# EAGLE design load_cell_amp_diy (EAGLE 9.5.2)
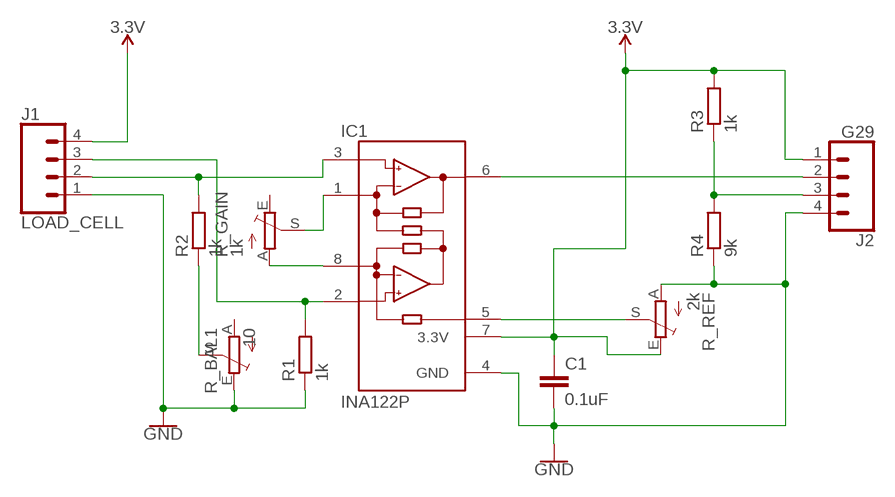
[diagram p0: schematic, sheet 1]

## Parts
C1  0.1uF  C2,5-3  [C2.5-3]
IC1  INA122P  [DIL08]
J1  LOAD_CELL  M04  [04P]
J2  G29  M04  [04P]
R1  1k  R-EU_0207/10  [0207/10]
R2  1k  R-EU_0207/10  [0207/10]
R3  1k  R-EU_0207/10  [0207/10]
R4  9k  R-EU_0207/10  [0207/10]
R_BAL1  10  TRIM_EU-RJ9W  [RJ9W]
R_GAIN  1k  TRIM_EU-RJ9W  [RJ9W]
R_REF  2k  TRIM_EU-RJ9W  [RJ9W]

## Nets
3.3V: C1.1 IC1.7(3.3V) J1.4 J2.1 R3.2 R_REF.E
CLUTCH: IC1.6(OUT) J2.2
GND: C1.2 IC1.4(GND) J1.1 J2.4 R1.1 R4.1 R_BAL1.E R_REF.A
N$1: IC1.8(RG) R_GAIN.A
N$2: IC1.1(RG) R_GAIN.S
N$3: IC1.3(+IN) J1.2 R2.2
N$4: IC1.2(-IN) J1.3 R1.2
N$5: R2.1 R_BAL1.S
N$6: IC1.5(REF) R_REF.S
N$9: J2.3 R3.1 R4.2
Unconnected: R_BAL1.A R_GAIN.E

## Library data of the parts
C1 = load_cell_amp:C: CAPACITOR naming: grid - package width
IC1 = load_cell_amp:INA122: Instrumentation Amplifier Single Supply, MicroPower; MF: TEXAS INSTRUMENTS; MPN: INA122P; OC_FARNELL: 1459460; OC_NEWARK: 15M0948
J1 J2 = load_cell_amp:M04: AMP QUICK CONNECTOR; OC_FARNELL: unknown; OC_NEWARK: unknown
R1-R4 = load_cell_amp:R-EU_: RESISTOR, European symbol; SPICEPREFIX: R
R_BAL1 R_GAIN R_REF = load_cell_amp:TRIM_EU-: POTENTIOMETER

## Board
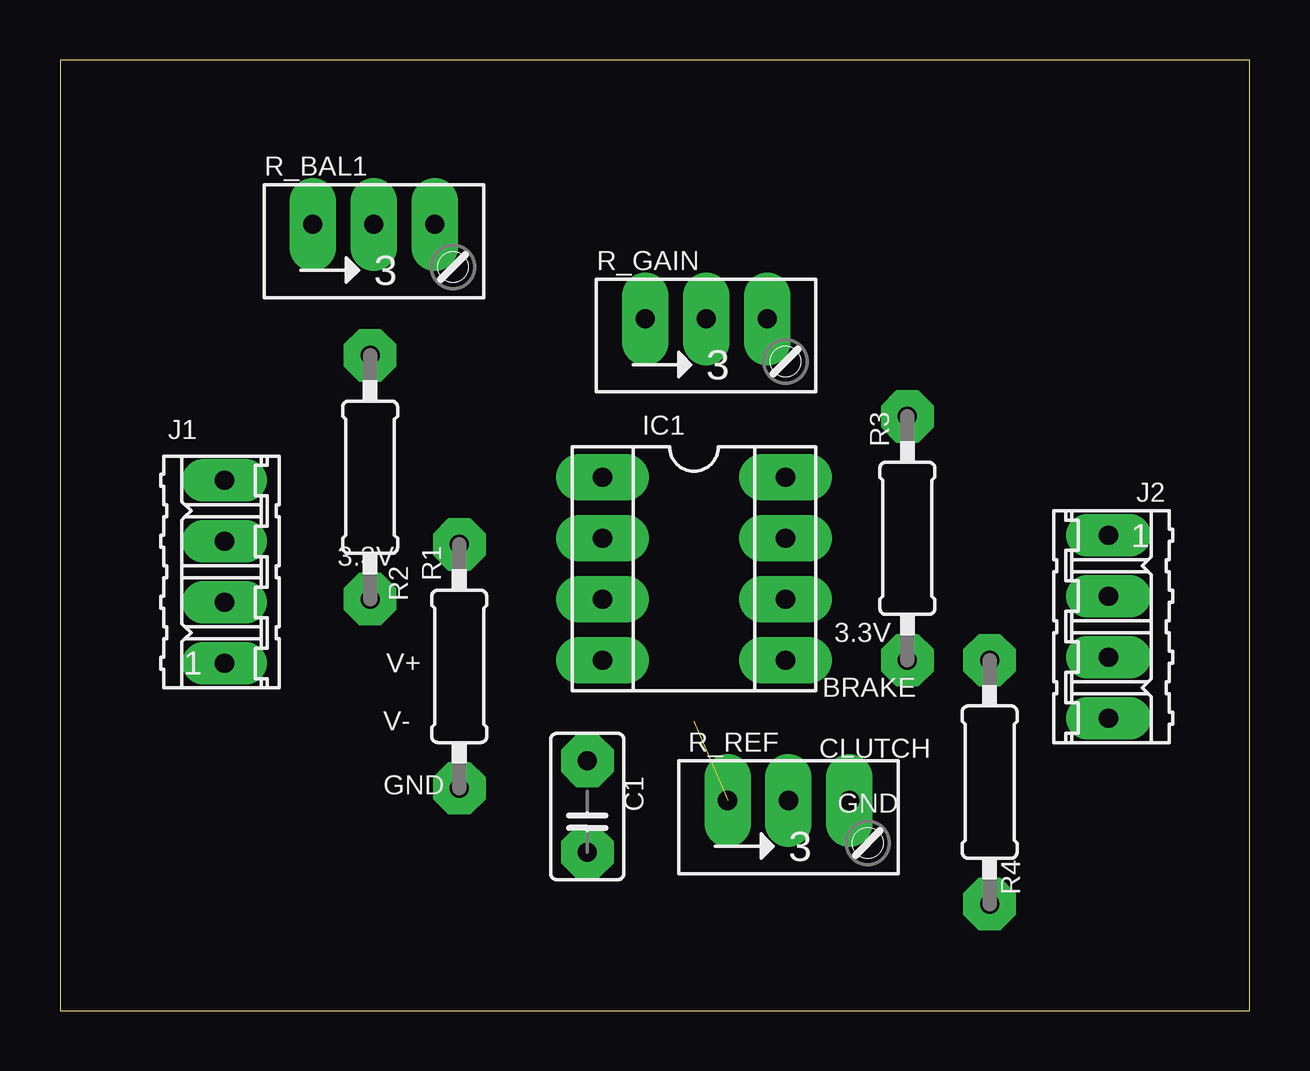
[diagram p1: board, top side]
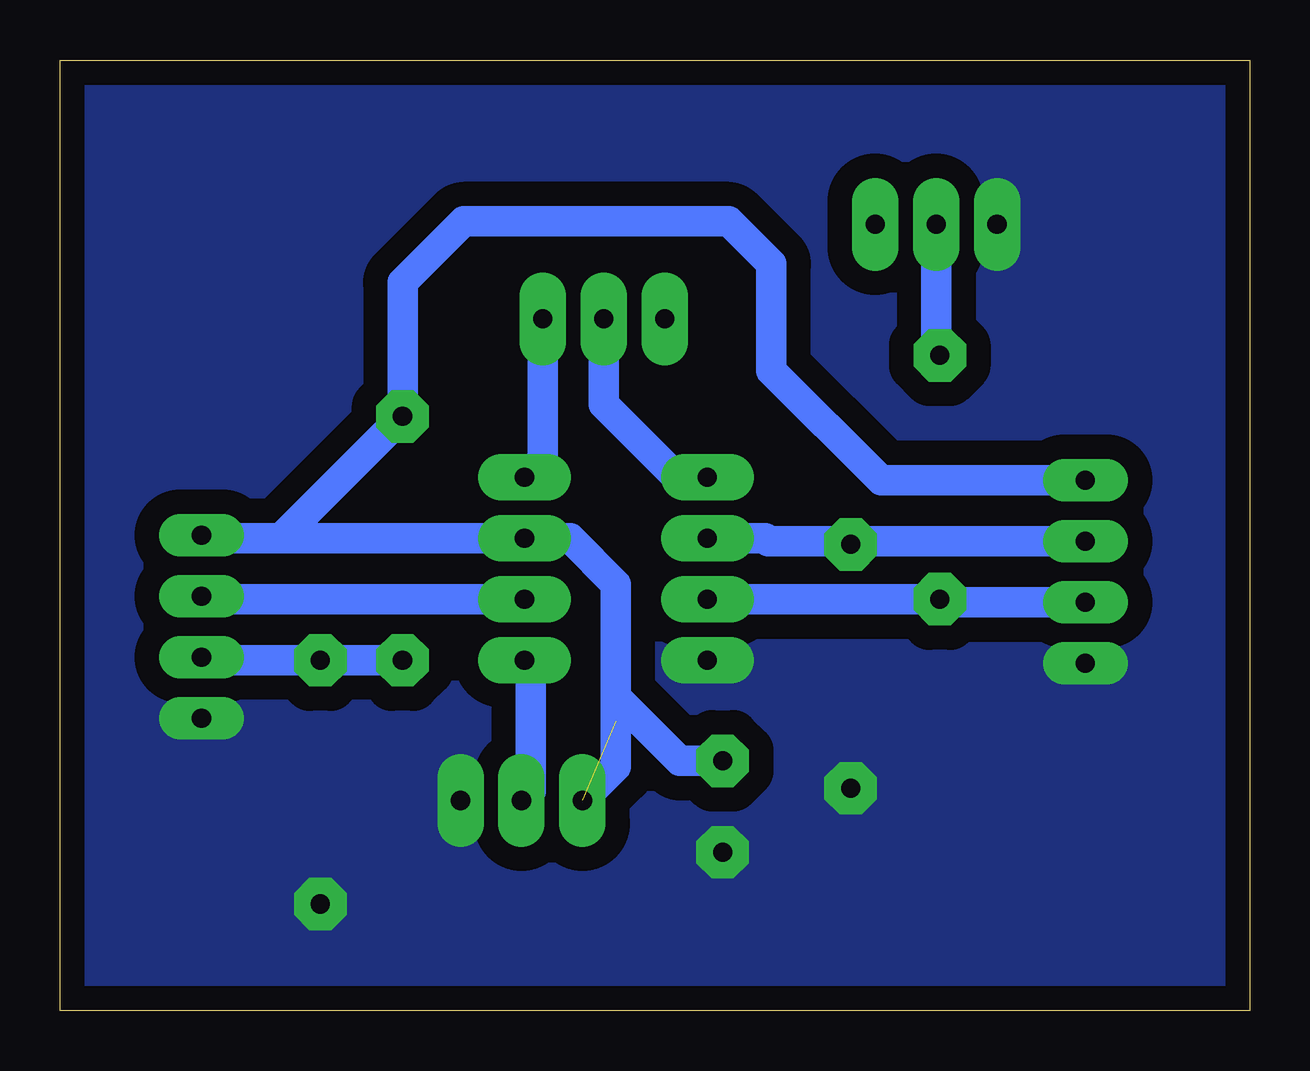
[diagram p2: board, bottom side, seen from below]

Size 49.58 x 39.61 mm. Coordinates in mm from the lower left corner, seen from the top.
Outline: 0,0 49.58,0 49.58,39.61 0,39.61 0,0
Copper layers (1*16): Top 0.035mm / dielectric 1.5mm / Bottom 0.035mm
Design rules "default": minimum track width 6mil, minimum drill 0.35mm, track to track 6mil, track to pad 6mil, pad to pad 6mil, via to via 6mil, smd to smd 6mil, copper to edge 40mil, drill to drill 6mil, minimum pad ring 10mil, minimum via ring 8mil, stop-mask expansion 4mil, vias tented up to drill 0mil, thermal gap 10mil

### Footprints (pad centres in the part's own frame; a part is rotated, then mirrored left to right if it is on the bottom)
C2.5-3 = drill 0.8 pad 2.184 octagon: 1 -2.54,0; 2 1.27,0
DIL08 = drill 0.8 pad 1.93 long: 1 -3.81,-3.81; 2 -1.27,-3.81; 3 1.27,-3.81; 4 3.81,-3.81; 5 3.81,3.81; 6 1.27,3.81; 7 -1.27,3.81; 8 -3.81,3.81
04P = drill 0.8 pad 1.778 long: 1 -3.81,0; 2 -1.27,0; 3 1.27,0; 4 3.81,0
0207/10 = drill 0.8 pad 2.184 octagon: 1 -5.08,0; 2 5.08,0
RJ9W = drill 0.8 pad 1.93 long: A 2.54,0.635; E -2.54,0.635; S 0,0.635

### Placement (x,y rotation side)
C1  21.97,7.87 270 top
IC1  26.42,18.42 270 top
J1  6.86,18.29 90 top
J2  43.69,16 270 top
R1  16.64,14.35 90 top
R2  12.92,22.23 270 top
R3  35.31,19.68 90 top
R4  38.73,9.53 90 top
R_BAL1  13.08,32.13 0 top
R_GAIN  26.92,28.19 0 top
R_REF  30.35,8.13 0 top

### Tracks (layer width: path | path; a pad name or v marks a point on that pad's centre or on a via)
3.3V  (1 unrouted)
  Bottom 1.27: IC1.7 28.32,19.68 26.42,17.78 26.42,12.07 | 6.84,22.11 J1.4 15.37,22.1 19.94,26.67 19.94,31.11 21.72,32.89 32.77,32.89 35.31,30.35 R3.2 | R3.2 35.18,24.64 | 32.77,19.68 IC1.7 | IC1.7 40.39,19.68 | J2.1 43.56,19.68 40.39,19.68 | C1.1 23.75,10.41 26.42,13.08 26.42,10.16 R_REF.E | R3.2 40.39,19.68
CLUTCH
  Bottom 1.27: IC1.6 43.56,17.14 J2.2
GND
  pour Bottom (isolate 1.016, no thermals): -2.89,-7.59 52.7,-7.59 52.7,43.56 -2.89,43.56
N$1
  Bottom 1.27: R_GAIN.A 29.46,22.99 IC1.8
N$2
  Bottom 1.27: R_GAIN.S 26.92,25.27 23.88,22.22 IC1.1
N$3
  Bottom 1.27: J1.2 12.79,17.02 R2.2 IC1.3
N$4
  Bottom 1.27: J1.3 16.51,19.56 R1.2 16.76,19.56 20.07,19.56 20.19,19.68 IC1.2
N$5
  Bottom 1.27: R2.1 13.08,27.46 R_BAL1.S
N$6
  Bottom 1.27: R_REF.S 29.97,9.14 29.97,14.35 IC1.5
N$9
  Bottom 1.27: 35.43,14.48 R3.1 R4.2 43.56,14.61 J2.3

### Text on the board
tNames: 3.3V | 3.3V | V+ | BRAKE | V- | CLUTCH | GND | GND